# EAGLE schematic PCU_R3 (EAGLE 7.7.0)
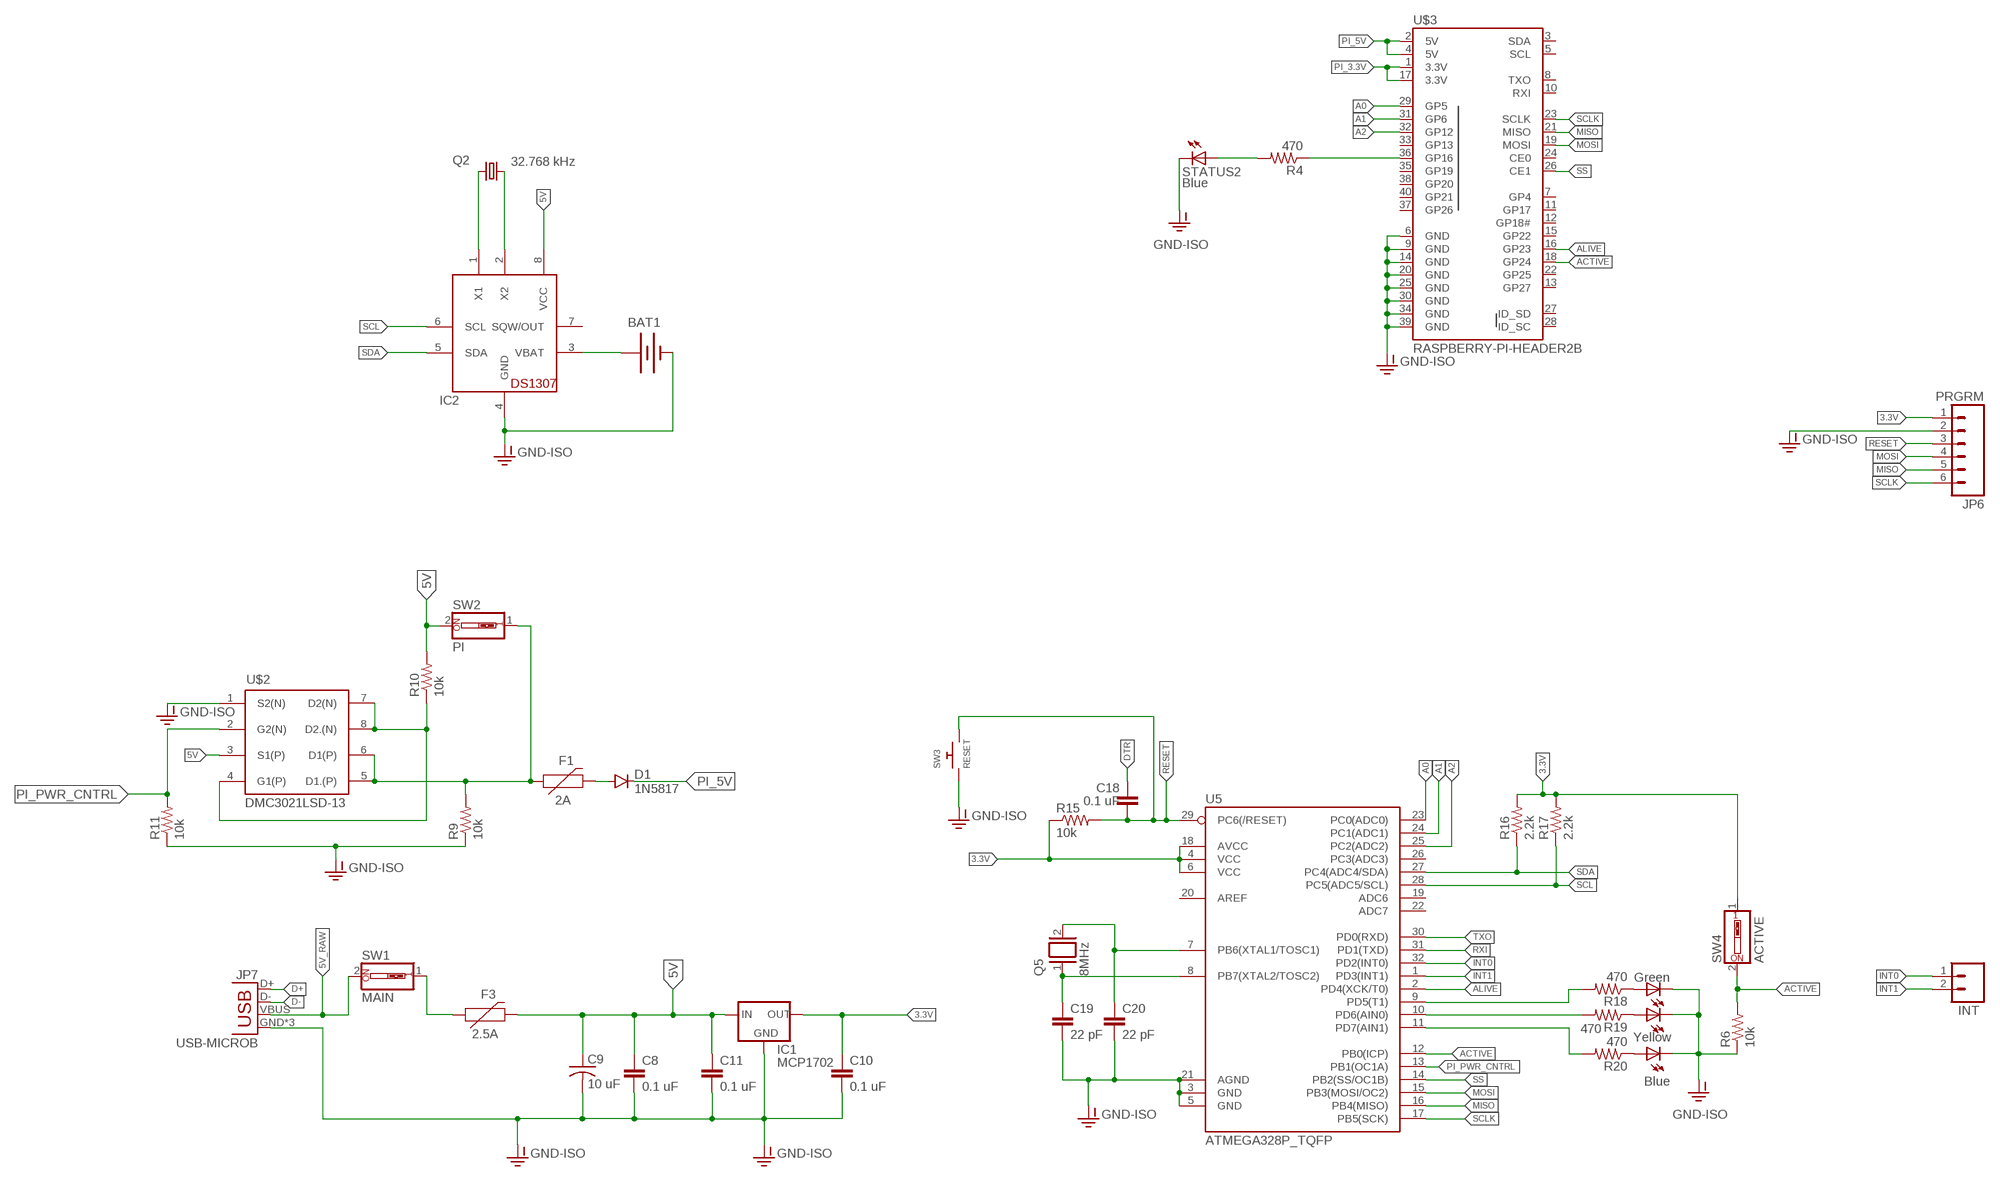
[diagram p0: schematic, sheet 1]

## Parts
BAT1  BATTERY12MM  [BATTCON_12MM]
C8  0.1 uF  1.0UF-1206-50V-10%  [1206]
C9  10 uF  C-USC1206  [C1206]
C10  0.1 uF  1.0UF-1206-50V-10%  [1206]
C11  0.1 uF  1.0UF-1206-50V-10%  [1206]
C18  0.1 uF  1.0UF-1206-50V-10%  [1206]
C19  22 pF  1.0UF-1206-50V-10%  [1206]
C20  22 pF  1.0UF-1206-50V-10%  [1206]
D1  1N5817  DIODEPTH  [DIODE-1N4001]
F1  2A  PPTC_HALF-AMP  [1206]
F3  2.5A  PPTC_HALF-AMP  [1206]
IC1  MCP1702  MCP1700TRI  [TO92]
IC2  DS1307  [DIL08]
INT  M02PTH  [1X02]
JP6  PRGRM  M06SILK_FEMALE_PTH  [1X06]
JP7  USB-MICROB  [USB-MICROB]
LED6  Green  LEDCHIPLED_1206  [CHIPLED_1206]
LED7  Yellow  LEDCHIPLED_1206  [CHIPLED_1206]
LED8  Blue  LEDCHIPLED_1206  [CHIPLED_1206]
Q2  32.768 kHz  CRYSTALTC38H  [TC38H]
Q5  8MHz  XTAL/S  [QS]
R4  470  RESISTOR1206  [1206]
R6  10k  RESISTOR1206  [1206]
R9  10k  R-US_R1206  [R1206]
R10  10k  R-US_R1206  [R1206]
R11  10k  R-US_R1206  [R1206]
R15  10k  RESISTOR1206  [1206]
R16  2.2k  RESISTOR1206  [1206]
R17  2.2k  RESISTOR1206  [1206]
R18  470  RESISTOR1206  [1206]
R19  470  RESISTOR1206  [1206]
R20  470  RESISTOR1206  [1206]
STATUS2  Blue  LEDCHIPLED_1206  [CHIPLED_1206]
SW1  MAIN  SW_DIP-1  [EDG-01]
SW2  PI  SW_DIP-1  [EDG-01]
SW3  RESET  SWITCH_PUSHBUTTONSOFTTOUCHSMD_SJ  [PUSHBUTTON_SMD_SJ]
SW4  ACTIVE  SW_DIP-1  [EDG-01]
U5  ATMEGA328P_TQFP  [TQFP32-08]
U$2  DMC3021LSD-13  [SOIC-8]
U$3  RASPBERRY-PI-HEADER2B  [2X20-NOSILK]

## Nets
3.3V: C10.1 IC1.3(OUT) JP6.1 R15.1 R16.2 R17.2 SW4.1 U5.4(VCC) U5.6(VCC) U5.18(AVCC)
5V [pi]: C8.1 C9.1 C11.1 F3.2 IC1.2(IN) IC2.8(VCC) R10.2 SW2.2 U$2.3(S1(P))
5V_RAW [pi]: JP7.VBUS SW1.2
5V_SWITCH [pi]: F3.1 SW1.1
A0: U5.23(PC0(ADC0)) U$3.29(GP5)
A1: U5.24(PC1(ADC1)) U$3.31(GP6)
A2: U5.25(PC2(ADC2)) U$3.32(GP12)
ACTIVE: R6.2 SW4.2 U5.12(PB0(ICP)) U$3.18(GP24)
ALIVE: U5.2(PD4(XCK/T0)) U$3.16(GP23)
D+: JP7.D+
D-: JP7.D-
DTR: C18.1
FUSE_DIODE_PI [pi]: D1.A F1.2
GND-ISO [pi]: BAT1.GND(-) C8.2 C9.2 C10.2 C11.2 C19.2 C20.2 IC1.1(GND) IC2.4(GND) JP6.2 JP7.GND JP7.MT1(GND) JP7.MT2(GND) LED6.C LED7.C LED8.C R6.1 R9.1 R11.1 STATUS2.C SW3.P$1 U5.3(GND) U5.5(GND) U5.21(AGND) U$2.1(S2(N)) U$3.6(GND) U$3.9(GND) U$3.14(GND) U$3.20(GND) U$3.25(GND) U$3.30(GND) U$3.34(GND) U$3.39(GND)
GP16: R4.1 U$3.36(GP16)
INT0: INT.1 U5.32(PD2(INT0))
INT1: INT.2 U5.1(PD3(INT1))
MISO: JP6.5 U5.16(PB4(MISO)) U$3.21(MISO)
MOSI: JP6.4 U5.15(PB3(MOSI/OC2)) U$3.19(MOSI)
N$3: IC2.1(X1) Q2.1
N$4: IC2.2(X2) Q2.2
N$5: BAT1.PWR@1(+) IC2.3(VBAT)
N$10: R4.2 STATUS2.A
N$25: LED6.A R18.1
N$26: LED7.A R19.1
N$27: LED8.A R20.1
PD5: R18.2 U5.9(PD5(T1))
PD6: R19.2 U5.10(PD6(AIN0))
PD7: R20.2 U5.11(PD7(AIN1))
PI_3.3V: U$3.1(3.3V) U$3.17(3.3V)
PI_5V [pi]: D1.C U$3.2(5V) U$3.4(5V)
PI_N_DRAIN: R10.1 U$2.4(G1(P)) U$2.7(D2(N)) U$2.8(D2.(N))
PI_P_DRAIN [pi]: F1.1 R9.2 SW2.1 U$2.5(D1.(P)) U$2.6(D1(P))
PI_PWR_CNTRL: R11.2 U5.13(PB1(OC1A)) U$2.2(G2(N))
RESET: C18.2 JP6.3 R15.2 SW3.P$2 U5.29(PC6(/RESET))
RXI: U5.31(PD1(TXD))
SCL: IC2.6(SCL) R17.1 U5.28(PC5(ADC5/SCL))
SCLK: JP6.6 U5.17(PB5(SCK)) U$3.23(SCLK)
SDA: IC2.5(SDA) R16.1 U5.27(PC4(ADC4/SDA))
SS: U5.14(PB2(SS/OC1B)) U$3.26(CE1)
TXO: U5.30(PD0(RXD))
XTAL1: C20.1 Q5.2 U5.7(PB6(XTAL1/TOSC1))
XTAL2: C19.1 Q5.1 U5.8(PB7(XTAL2/TOSC2))
Unconnected: IC2.7(SQW/OUT) U5.19(ADC6) U5.20(AREF) U5.22(ADC7) U5.26(PC3(ADC3)) U$3.3(SDA) U$3.5(SCL) U$3.7(GP4) U$3.8(TXO) U$3.10(RXI) U$3.11(GP17) U$3.12(GP18#) U$3.13(GP27) U$3.15(GP22) U$3.22(GP25) U$3.24(CE0) U$3.27(ID_SD) U$3.28(ID_SC) U$3.33(GP13) U$3.35(GP19) U$3.37(GP26) U$3.38(GP20) U$3.40(GP21)

## Library data of the parts
BAT1 = SparkFun-Electromechanical:BATTERY: Battery Holders Various common sizes : AA, AAA, 18650 (PRT-12895), 20mm coin cell and 12mm coin cell. 20MM_4LEGS, BATT-10373; PROD_ID: BATT-08044
C8 C10 C11 C18-C20 = SparkFun-Capacitors:1.0UF: 1µF ceramic capacitors A capacitor is a passive two-terminal electrical component used to store electrical energy temporarily in an electric field.; PROD_ID: CAP-09822; VALUE: 1.0uF
C9 = adafruit:C-US: CAPACITOR, American symbol
D1 = SparkFun-DiscreteSemi:DIODE: Diode These are standard reverse protection diodes and small signal diodes. SMA package can handle up to about 1A. SOD-323 can handle about 200mA. What the SOD-323 package when ordering, there are some mfgs out there that are 5-pin packages.
F1 F3 = SparkFun-Fuses:PPTC: Resettable Fuse PPTC Resettable Fuse. Really a sort of resistor with a polymeric positive temperature coefficient whose resistance increases dramatically with an increase in temperature. When heated by the power passing through the resistance rises causing the current to be limited, protecting the circuit. This is achieved by the transition of the polymer from a crystalline to an amorphous state where the conductive carbon separates breaking the conductive pathways found in the cool crystalline structure. When a PPTC cools back down it resumes conducting letting the circuit turn back on. SparkFun Products: SparkFun RedBoard - Programmed with Arduino <https://www.sparkfun.com/products/12757> Pro Micro - 5V/16MHz <https://www.sparkfun.com/products/12640> Arduino Pro 328 - 5V/16MHz <https://www.sparkfun.com/products/10915> MP3 Trigger <https://www.sparkfun.com/products/13720>; PROD_ID: RES-08585; VALUE: 6V/0.5A
IC1 = adafruit:MCP1700: VOLTAGE REGULATOR
IC2 = adafruit:DS1307: DS1307 Real time clock (RTC) with battery backup ability. Talk to it via i2c
INT = SparkFun-Connectors:M02: Standard 2-pin 0.1" header. Use with - straight break away headers ( PRT-00116) - right angle break away headers (PRT-00553) - swiss pins (PRT-00743) - machine pins (PRT-00117) - female headers (PRT-00115) Molex polarized connector foot print use with: PRT-08233 with associated crimp pins and housings. 2.54_SCREWTERM for use with PRT-10571. 3.5mm Screw Terminal footprints for PRT-08084 5mm Screw Terminal footprints for use with PRT-08432
JP6 = SparkFun-Connectors:M06: Header 6 Standard 6-pin 0.1" header. Use with straight break away headers (SKU : PRT-00116), right angle break away headers (PRT-00553), swiss pins (PRT-00743), machine pins (PRT-00117), and female headers (PRT-00115). Molex polarized connector foot print use with SKU : PRT-08094 with associated crimp pins and housings. NOTES ON THE VARIANTS LOCK and LOCK_LONGPADS... This footprint was designed to help hold the alignment of a through-hole component (i.e. 6-pin header) while soldering it into place. You may notice that each hole has been shifted either up or down by 0.005 of an inch from it's more standard position (which is a perfectly straight line). This slight alteration caused the pins (the squares in the middle) to touch the edges of the holes. Because they are alternating, it causes a "brace" to hold the component in place. 0.005 has proven to be the perfect amount of "off-center" position when using our standard breakaway headers. Although looks a little odd when you look at the bare footprint, once you have a header in there, the alteration is very hard to notice. Also,if you push a header all the way into place, it is covered up entirely on the bottom side. This idea of altering the position of holes to aid alignment will be further integrated into the Sparkfun Library for other footprints. It can help hold any component with 3 or more connection pins.; PROD_ID: CONN-08437
JP7 = SparkFun-Connectors:USB: USB Connectors USB-B-PTH is fully proven SKU : PRT-00139/CONN-08278 USB-miniB is fully proven SKU : PRT-00587 USB-A-PCB is untested. USB-A-H is throughly reviewed, but untested. Spark Fun Electronics SKU : PRT-00437 USB-B-SMT is throughly reviewed, but untested. Needs silkscreen touching up. USB-A-S has not been used/tested USB-MB-H has not been used/tested USB-MICROB has been used. CONN-09505; PROD_ID: CONN-09505
LED6-LED8 STATUS2 = adafruit:LED: LED OSRAM: - CHIPLED LG R971, LG N971, LY N971, LG Q971, LY Q971, LO R971, LY R971 LH N974, LH R974 LS Q976, LO Q976, LY Q976 LO Q996 - Hyper CHIPLED LW Q18S LB Q993, LB Q99A, LB R99A - SideLED LS A670, LO A670, LY A670, LG A670, LP A670 LB A673, LV A673, LT A673, LW A673 LH A674 LY A675 LS A676, LA A676, LO A676, LY A676, LW A676 LS A679, LY A679, LG A679 - Hyper Micro SIDELED® LS Y876, LA Y876, LO Y876, LY Y876 LT Y87S - SmartLED LW L88C, LW L88S LB L89C, LB L89S, LG L890 LS L89K, LO L89K, LY L89K LS L896, LA L896, LO L896, LY L896 - TOPLED LS T670, LO T670, LY T670, LG T670, LP T670 LSG T670, LSP T670, LSY T670, LOP T670, LYG T670 LG T671, LOG T671, LSG T671 LB T673, LV T673, LT T673, LW T673 LH T674 LS T676, LA T676, LO T676, LY T676, LB T676, LH T676, LSB T676, LW T676 LB T67C, LV T67C, LT T67C, LS T67K, LO T67K, LY T67K, LW E67C LS E67B, LA E67B, LO E67B, LY E67B, LB E67C, LV E67C, LT E67C LW T67C LS T679, LY T679, LG T679 LS T770, LO T770, LY T770, LG T770, LP T770 LB T773, LV T773, LT T773, LW T773 LH T774 LS E675, LA E675, LY E675, LS T675 LS T776, LA T776, LO T776, LY T776, LB T776 LHGB T686 LT T68C, LB T68C - Hyper Mini TOPLED® LB M676 - Mini TOPLED Santana® LG M470 LS M47K, LO M47K, LY M47K Source: http://www.osram.convergy.de/
Q2 = adafruit:CRYSTAL: CRYSTAL; OC_FARNELL: unknown; OC_NEWARK: unknown
Q5 = special:XTAL/S: CRYSTAL
R4 R6 R15-R20 = SparkFun-Passives:RESISTOR: Resistor Basic schematic elements and footprints for 0603, 1206, and PTH resistors.
R9-R11 = adafruit:R-US_: RESISTOR, American symbol
SW1 SW2 SW4 = special:SW_DIP-1: DIP SWITCH
SW3 = adafruit:SWITCH_PUSHBUTTON: Buttons SOFTTOUCHSMD_SJ - Soft touch temporary push button (Super Junk Akihabara) Compatible with SKPMANE010 [Mouser: 688-SKPMAN] C&K_KSS = Digikey: KSS221GLFS
U5 = SparkFun-IC-Microcontroller:ATMEGA328P_TQFP: Popular 328P in QFP Storefront component: ATmega328 - TQFP <https://www.sparkfun.com/products/13448> (COM-13448) Datasheet <http://www.sparkfun.com/datasheets/Components/SMD/ATMega328.pdf> SparkFun Products SparkFun RedBoard - Programmed with Arduino <https://www.sparkfun.com/products/12757> (DEV-12757) Arduino Pro Mini 328 - 5V/16MHz <https://www.sparkfun.com/products/11113> (DEV-11113) Arduino Pro Mini 328 - 3.3V/8MHz <https://www.sparkfun.com/products/11114> (DEV-11114) SparkFun OpenLog <https://www.sparkfun.com/products/13712> (DEV-13712) SparkFun MicroView - OLED Arduino Module <https://www.sparkfun.com/products/12923> (DEV-12923) SparkFun Digital Sandbox <https://www.sparkfun.com/products/12651> (DEV-12651) SparkFun PicoBoard <https://www.sparkfun.com/products/11888> (WIG-11888) Arduino Fio <https://www.sparkfun.com/products/10116> (DEV-10116) LilyPad Arduino 328 Main Board <https://www.sparkfun.com/products/13342> (DEV-13342) SparkFun RedStick <https://www.sparkfun.com/products/13741> (DEV-13741) LilyPad MP3 <https://www.sparkfun.com/products/11013> (DEV-11013) LilyPad Arduino SimpleSnap <https://www.sparkfun.com/products/10941> (DEV-10941) SparkFun Stepoko <https://www.sparkfun.com/products/13899> (ROB-13899) SparkFun Geiger Counter <https://www.sparkfun.com/products/11345> (SEN-11345) SparkFun EL Sequencer <https://www.sparkfun.com/products/12781> (COM-12781) Arduino Pro 328 - 5V/16MHz <https://www.sparkfun.com/products/10915> (DEV-10915) CryptoCape <https://www.sparkfun.com/products/12773> (DEV-12773) SparkFun IR Thermometer Evaluation Board - MLX90614 <https://www.sparkfun.com/products/10740> (SEN-10740) SparkFun RedBot Mainboard <https://www.sparkfun.com/products/12097> (ROB-12097) Arduino Pro 328 - 3.3V/8MHz <https://www.sparkfun.com/products/10914> (DEV-10914) SparkFun Block for Intel® Edison - Arduino <https://www.sparkfun.com/products/13036> (DEV-13036) SparkFun Simon Says - Surface Mount Soldering Kit <https://www.sparkfun.com/products/10935> (KIT-10935) SparkFun 7-Segment Serial Display - Red <https://www.sparkfun.com/products/11441> (COM-11441) SparkFun 7-Segment Serial Display - White <https://www.sparkfun.com/products/11629> (COM-11629) SparkFun 7-Segment Serial Display - Yellow <https://www.sparkfun.com/products/11443> (COM-11443) SparkFun 7-Segment Serial Display - Kelly Green <https://www.sparkfun.com/products/11440> (COM-11440) SparkFun 7-Segment Serial Display - Blue <https://www.sparkfun.com/products/11442> (COM-11442) SparkFun OpenSegment Serial Display - 20mm (Blue) <https://www.sparkfun.com/products/11647> (COM-11647) SparkFun OpenSegment Serial Display - 20mm (Green) <https://www.sparkfun.com/products/11646> (COM-11646) SparkFun OpenSegment Serial Display - 20mm (White) <https://www.sparkfun.com/products/11648> (COM-11648) SparkFun OpenSegment Serial Display - 20mm (Red) <https://www.sparkfun.com/products/11644> (COM-11644) SparkFun OpenSegment Serial Display - 20mm (Yellow) <https://www.sparkfun.com/products/11645> (COM-11645) SparkFun OpenSegment Shield <https://www.sparkfun.com/products/13190> (DEV-13190); PROD_ID: IC-09069
U$2 = custom:DMC3021LSD
U$3 = custom:RASPBERRY-PI-HEADER

## Net classes
1 actuator: width 0.813 mm, clearance 0.229 mm
2 pi: width 0.508 mm